# EAGLE schematic olm-ec-periph (EAGLE 6.5.0)
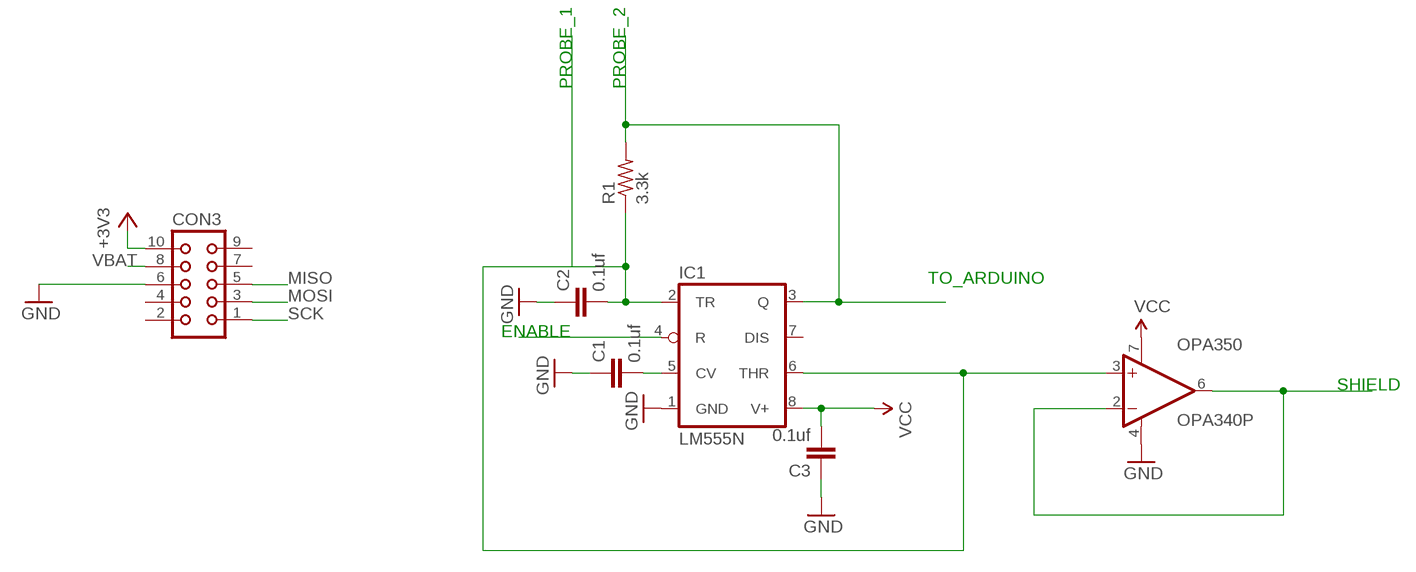
[diagram p0: schematic, sheet 1]

## Parts
C1  0.1uf  C-EU025-025X050  [C025-025X050]
C2  0.1uf  C-EU025-025X050  [C025-025X050]
C3  0.1uf  C-EU025-025X050  [C025-025X050]
CON3  CON10  [CON10]
IC1  LM555N  [DIL08]
OPA350  OPA340P  [DIL08]
R1  3.3k  R-US_0207/10  [0207/10]

## Nets
+3V3: CON3.10
ENABLE: IC1.4(R)
GND: C1.1 C2.1 C3.1 CON3.6 IC1.1(GND) OPA350.4(V-)
MISO: CON3.5
MOSI: CON3.3
N$1: C1.2 IC1.5(CV)
PROBE_1: C2.2 IC1.2(TR) IC1.6(THR) OPA350.3(+IN) R1.1
PROBE_2: IC1.3(Q) R1.2
SCK: CON3.1
SHIELD: OPA350.2(-IN) OPA350.6(OUT)
VBAT: CON3.8
VCC: C3.2 IC1.8(V+) OPA350.7(V+)
Unconnected: CON3.2 CON3.4 CON3.7 CON3.9 IC1.7(DIS)

## Notes on the sheet
- PROBE_1 | PROBE_2
- TO_ARDUINO
- ENABLE
- SHIELD

## Library data of the parts
C1-C3 = resistor:C-EU: CAPACITOR, European symbol
CON3 = con-harting:CON10: CONNECTOR; OC_FARNELL: unknown; OC_NEWARK: unknown
IC1 = linear:*555: TIMER
OPA350 = burr-brown:OPA340: Rail-to-Rail Operational Amplifiers Single-Supply, MicroAmplifier(TM) Series
R1 = rcl:R-US_: RESISTOR, American symbol